# Altium project CentraleProject.PrjPcb
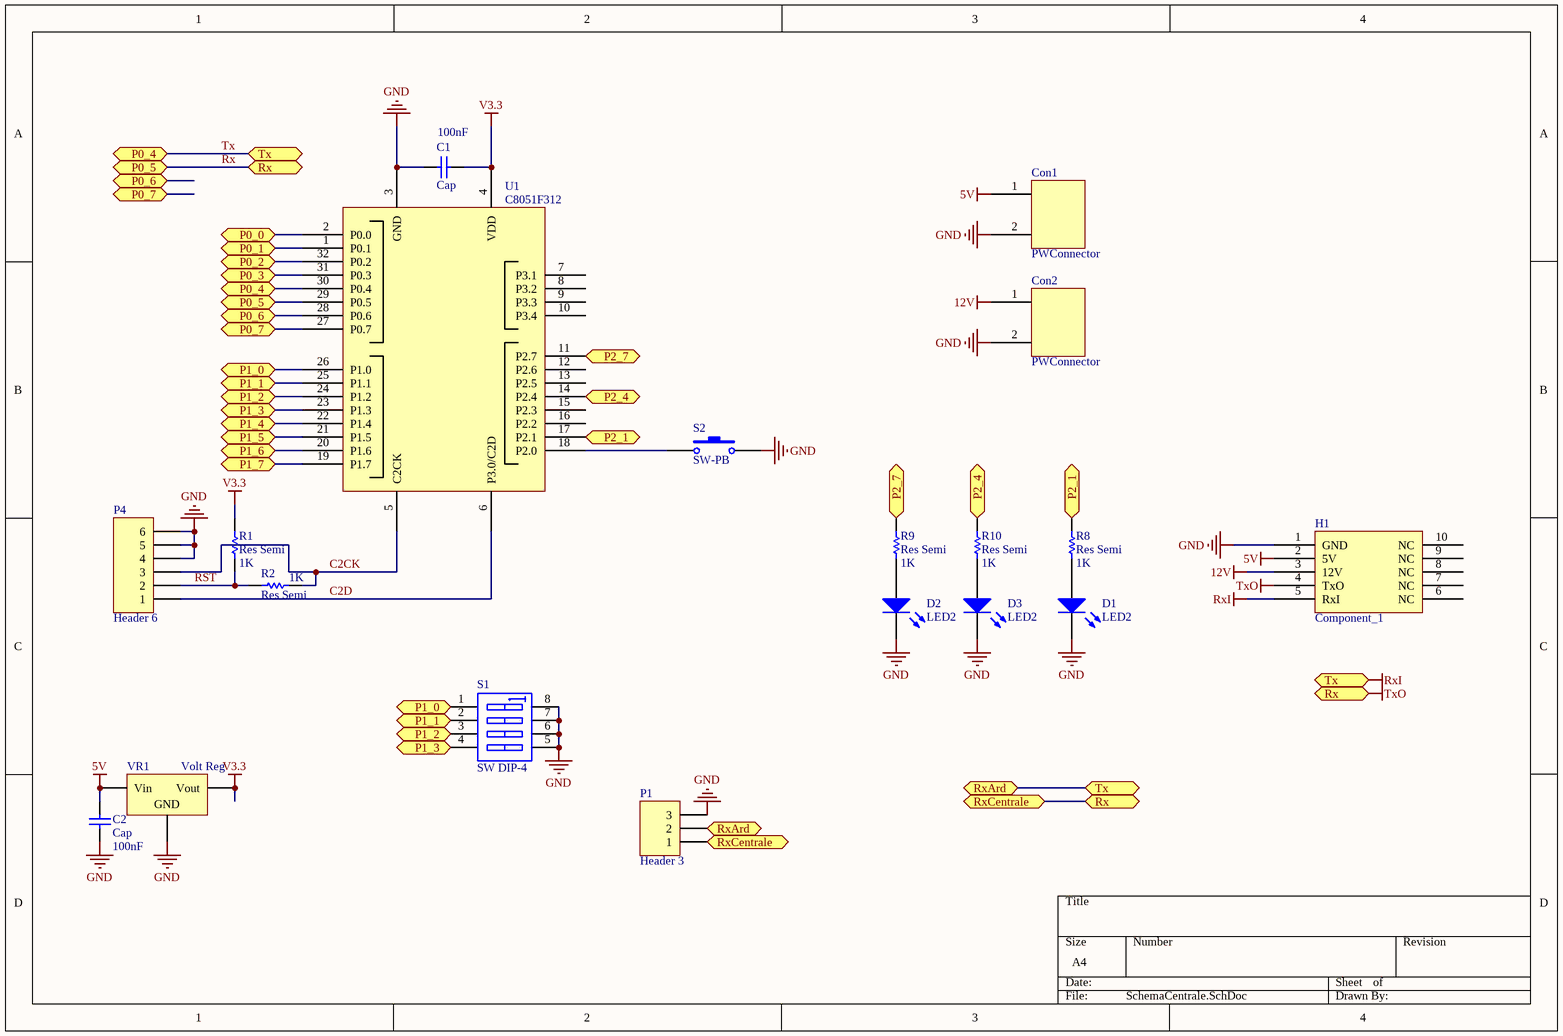
[diagram p0: SchemaCentrale.SchDoc]
1 sheet, 19 parts. Net scope: flat (ports and power ports of the same name join across sheets).
Board file: PCB1.PcbDoc

## Sheet SchemaCentrale.SchDoc
size A4

### Parts
C1  Cap  value 100nF  [C1206]
C2  Cap  value 100nF  [C1206]
Con1  PWConnector  [PWConnector]
Con2  PWConnector  [PWConnector]
D1  LED2  [3216[1206]]
D2  LED2  [3216[1206]]
D3  LED2  [3216[1206]]
H1  Component_1  [Header10Coude]
P1  Header 3  [HDR1X3]
P4  Header 6  [Edge Connector 4pts 1mm]
R1  Res Semi  value 1K  [1608[0603]]
R2  Res Semi  value 1K  [1608[0603]]
R8  Res Semi  value 1K  [2012[0805]]
R9  Res Semi  value 1K  [2012[0805]]
R10  Res Semi  value 1K  [2012[0805]]
S1  SW DIP-4  [DIP-P8]
S2  SW-PB  [Switch]
U1  C8051F312  [TQFP80P900X900X160-32N]
VR1  Volt Reg  [PG-SOT-223-4]

### Ports
P0_0, P0_1 (bidir), P0_2 (bidir), P0_3, P0_4, P0_5, P0_6, P0_7, P1_0, P1_1, P1_2, P1_3 (bidir), P1_4 (bidir), P1_5 (bidir), P1_6 (bidir), P1_7 (bidir), P2_1, P2_4, P2_7, Rx, RxArd, RxCentrale, Tx

### Nets
5V: C2.1 Con1.1 H1.2(5V) VR1.1(Vin)
12V: Con2.1 H1.3(12V)
GND: C1.2 C2.2 Con1.2 Con2.2 D1.2(K) D2.2(K) D3.2(K) H1.1(GND) P1.3 P4.4 P4.5 P4.6 S1.5(B4) S1.6(B3) S1.7(B2) S1.8(B1) S2.2 U1.3(GND) VR1.2(GND)
Rx: H1.4(TxO) P1.1 U1.29(P0.5) ; port Rx, port P0_5, port RxCentrale  [also labelled TxO]
Tx: H1.5(RxI) P1.2 U1.30(P0.4) ; port Tx, port P0_4, port RxArd  [also labelled RxI]
V3.3: C1.1 R1.2 U1.4(VDD) VR1.3(Vout)
C2CK: P4.3 R2.1 U1.5(C2CK)
C2D: P4.1 U1.6(P3.0/C2D)
RST: P4.2 R1.1 R2.2
NetD1_1: D1.1(A) R8.2
NetD2_1: D2.1(A) R9.2
NetD3_1: D3.1(A) R10.2
NetR8_1: R8.1 U1.17(P2.1) ; port P2_1
NetR9_1: R9.1 U1.11(P2.7) ; port P2_7
NetR10_1: R10.1 U1.14(P2.4) ; port P2_4
NetS1_1: S1.1(A1) U1.26(P1.0) ; port P1_0
NetS1_2: S1.2(A2) U1.25(P1.1) ; port P1_1
NetS1_3: S1.3(A3) U1.24(P1.2) ; port P1_2
NetS1_4: S1.4(A4) U1.23(P1.3) ; port P1_3
NetS2_1: S2.1 U1.18(P2.0)
NetU1_1: U1.1(P0.1) ; port P0_1
NetU1_2: U1.2(P0.0) ; port P0_0
NetU1_19: U1.19(P1.7) ; port P1_7
NetU1_20: U1.20(P1.6) ; port P1_6
NetU1_21: U1.21(P1.5) ; port P1_5
NetU1_22: U1.22(P1.4) ; port P1_4
NetU1_27: U1.27(P0.7) ; port P0_7
NetU1_28: U1.28(P0.6) ; port P0_6
NetU1_31: U1.31(P0.3) ; port P0_3
NetU1_32: U1.32(P0.2) ; port P0_2

Not connected (* = marked no-connect by the designer): H1 6(NC) 7(NC) 8(NC) 9(NC) 10(NC); U1 7(P3.1) 8(P3.2) 9(P3.3) 10(P3.4) 12(P2.6) 13(P2.5) 15(P2.3) 16(P2.2)

### Library data of the parts
C1 C2 = Cap: Capacitor; Published: 8-Jun-2000; LatestRevisionDate: 17-Jul-2002; LatestRevisionNote: Re-released for DXP Platform.; PackageReference: RAD-0.3; Publisher: Altium Limited
D1-D3 = LED2: Typical RED, GREEN, YELLOW, AMBER GaAs LED; Published: 8-Jun-2000; LatestRevisionDate: 17-Jul-2002; LatestRevisionNote: Re-released for DXP Platform.; PackageVersion: Feb-2002; PackageReference: 3.2X1.6X1.1; Publisher: Altium Limited; PackageDescription: SM LED; 2 Flat Leads
P1 = Header 3: Header, 3-Pin; LatestRevisionDate: 17-Jul-2002; LatestRevisionNote: Re-released for DXP Platform.; Publisher: Altium Limited
P4 = Header 6: Header, 6-Pin; LatestRevisionDate: 17-Jul-2002; LatestRevisionNote: Re-released for DXP Platform.; Publisher: Altium Limited
R1 R2 R8-R10 = Res Semi: Semiconductor Resistor; Published: 8-Jun-2000; LatestRevisionDate: 17-Jul-2002; LatestRevisionNote: Re-released for DXP Platform.; PackageReference: AXIAL-0.5; Publisher: Altium Limited
S1 = SW DIP-4: DIP Switch, 4 Position, SPST; Published: 24-Mar-1999; LatestRevisionDate: 29-May-2009; LatestRevisionNote: IPC-7351 Footprint Added.; PackageVersion: Dec-2002; PackageReference: SO8; Publisher: Altium Limited; PackageDescription: 8-Pin Small Outline Integrated Circuit 1.27 mm Pitch; Code_JEDEC: MS-012-AA; Code_IPC: SOIC127P600-8
S2 = SW-PB: Switch; Published: 24-Mar-1999; LatestRevisionDate: 17-Jul-2002; LatestRevisionNote: Re-released for DXP Platform.; PackageReference: SPST-2; Publisher: Altium Limited; PackageDescription: Switch; 2 Leads
U1 = C8051F310: Microcontrôleur Silabs
VR1 = Volt Reg: Voltage Regulator; Published: 24-Mar-1999; LatestRevisionDate: 17-Jul-2002; LatestRevisionNote: Re-released for DXP Platform.; PackageReference: D2PAK; Publisher: Altium Limited; Code_JEDEC: SMD-220